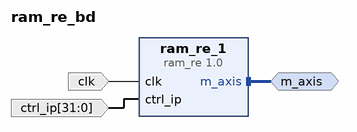
[diagram p0: block diagram of the top level]
# Vivado block design ram_re_bd, xczu28dr-ffvg1517-2-e, Vivado 2024.1
create_bd_design ram_re_bd

create_bd_intf_port -mode Master -vlnv xilinx.com:interface:axis_rtl:1.0 m_axis
create_bd_port -dir I -type clk clk
create_bd_port -dir I -from 31 -to 0 -type data ctrl_ip

create_bd_cell -type ip -vlnv CoRSoC:VMC:ram_re:1.0 ram_re_1

# ---- connections ----

connect_bd_intf_net [get_bd_intf_pins ram_re_1/m_axis] [get_bd_intf_ports m_axis]
connect_bd_net [get_bd_ports clk] [get_bd_pins ram_re_1/clk]
connect_bd_net [get_bd_ports ctrl_ip] [get_bd_pins ram_re_1/ctrl_ip]

validate_bd_design
save_bd_design
